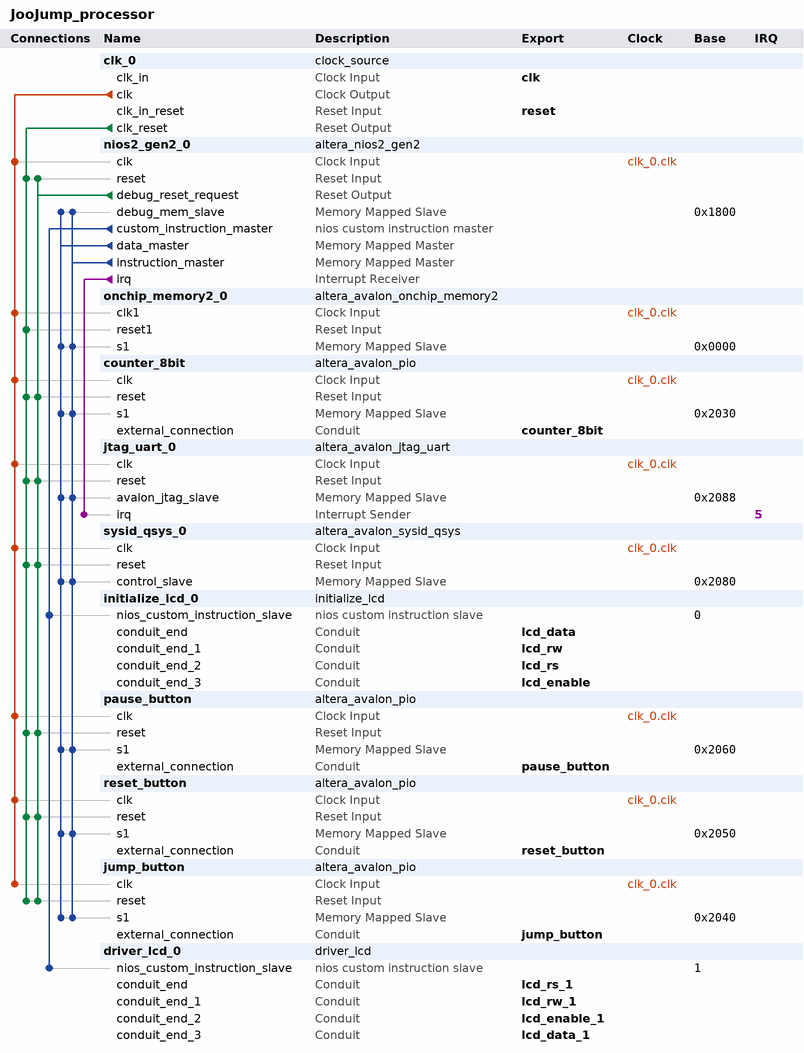
[diagram p0: system contents]
# Platform Designer (Qsys) system JooJump_processor, Cyclone IV E EP4CE6E22C8
# Parameters at their usual value, and those the tool derives, are not listed.
package require -exact qsys 18.0
create_system JooJump_processor
set_project_property DEVICE_FAMILY {Cyclone IV E}
set_project_property DEVICE EP4CE6E22C8

add_instance clk_0 clock_source 18.0
set_instance_parameter_value clk_0 clockFrequency 50000000

add_instance nios2_gen2_0 altera_nios2_gen2 18.0
set_instance_parameter_value nios2_gen2_0 dcache_size 2048
set_instance_parameter_value nios2_gen2_0 exceptionSlave onchip_memory2_0.s1
set_instance_parameter_value nios2_gen2_0 icache_size 4096
set_instance_parameter_value nios2_gen2_0 impl Tiny
set_instance_parameter_value nios2_gen2_0 resetSlave onchip_memory2_0.s1

add_instance onchip_memory2_0 altera_avalon_onchip_memory2 18.0
set_instance_parameter_value onchip_memory2_0 dataWidth 32
set_instance_parameter_value onchip_memory2_0 dualPort false
set_instance_parameter_value onchip_memory2_0 initMemContent true
set_instance_parameter_value onchip_memory2_0 initializationFileName onchip_mem.hex
set_instance_parameter_value onchip_memory2_0 memorySize 4096
set_instance_parameter_value onchip_memory2_0 useNonDefaultInitFile true

add_instance counter_8bit altera_avalon_pio 18.0
set_instance_parameter_value counter_8bit direction Input
set_instance_parameter_value counter_8bit width 8

add_instance jtag_uart_0 altera_avalon_jtag_uart 18.0
set_instance_parameter_value jtag_uart_0 simInteractiveOptions NO_INTERACTIVE_WINDOWS

add_instance sysid_qsys_0 altera_avalon_sysid_qsys 18.0
set_instance_parameter_value sysid_qsys_0 id 0

add_instance initialize_lcd_0 initialize_lcd 1.0

add_instance pause_button altera_avalon_pio 18.0
set_instance_parameter_value pause_button direction Input
set_instance_parameter_value pause_button width 1

add_instance reset_button altera_avalon_pio 18.0
set_instance_parameter_value reset_button direction Input
set_instance_parameter_value reset_button width 1

add_instance jump_button altera_avalon_pio 18.0
set_instance_parameter_value jump_button direction Input
set_instance_parameter_value jump_button width 1

add_instance driver_lcd_0 driver_lcd 1.0

# connections
add_connection clk_0.clk counter_8bit.clk clock
add_connection clk_0.clk jtag_uart_0.clk clock
add_connection clk_0.clk jump_button.clk clock
add_connection clk_0.clk nios2_gen2_0.clk clock
add_connection clk_0.clk onchip_memory2_0.clk1 clock
add_connection clk_0.clk pause_button.clk clock
add_connection clk_0.clk reset_button.clk clock
add_connection clk_0.clk sysid_qsys_0.clk clock
add_connection clk_0.clk_reset counter_8bit.reset reset
add_connection clk_0.clk_reset jtag_uart_0.reset reset
add_connection clk_0.clk_reset jump_button.reset reset
add_connection clk_0.clk_reset nios2_gen2_0.reset reset
add_connection clk_0.clk_reset onchip_memory2_0.reset1 reset
add_connection clk_0.clk_reset pause_button.reset reset
add_connection clk_0.clk_reset reset_button.reset reset
add_connection clk_0.clk_reset sysid_qsys_0.reset reset
add_connection nios2_gen2_0.debug_reset_request counter_8bit.reset reset
add_connection nios2_gen2_0.debug_reset_request jtag_uart_0.reset reset
add_connection nios2_gen2_0.debug_reset_request jump_button.reset reset
add_connection nios2_gen2_0.debug_reset_request nios2_gen2_0.reset reset
add_connection nios2_gen2_0.debug_reset_request pause_button.reset reset
add_connection nios2_gen2_0.debug_reset_request reset_button.reset reset
add_connection nios2_gen2_0.debug_reset_request sysid_qsys_0.reset reset
add_connection nios2_gen2_0.data_master counter_8bit.s1 avalon
set_connection_parameter_value nios2_gen2_0.data_master/counter_8bit.s1 baseAddress 0x2030
add_connection nios2_gen2_0.data_master jtag_uart_0.avalon_jtag_slave avalon
set_connection_parameter_value nios2_gen2_0.data_master/jtag_uart_0.avalon_jtag_slave baseAddress 0x2088
add_connection nios2_gen2_0.data_master jump_button.s1 avalon
set_connection_parameter_value nios2_gen2_0.data_master/jump_button.s1 baseAddress 0x2040
add_connection nios2_gen2_0.data_master nios2_gen2_0.debug_mem_slave avalon
set_connection_parameter_value nios2_gen2_0.data_master/nios2_gen2_0.debug_mem_slave baseAddress 0x1800
add_connection nios2_gen2_0.data_master onchip_memory2_0.s1 avalon
set_connection_parameter_value nios2_gen2_0.data_master/onchip_memory2_0.s1 baseAddress 0x0000
add_connection nios2_gen2_0.data_master pause_button.s1 avalon
set_connection_parameter_value nios2_gen2_0.data_master/pause_button.s1 baseAddress 0x2060
add_connection nios2_gen2_0.data_master reset_button.s1 avalon
set_connection_parameter_value nios2_gen2_0.data_master/reset_button.s1 baseAddress 0x2050
add_connection nios2_gen2_0.data_master sysid_qsys_0.control_slave avalon
set_connection_parameter_value nios2_gen2_0.data_master/sysid_qsys_0.control_slave baseAddress 0x2080
add_connection nios2_gen2_0.instruction_master counter_8bit.s1 avalon
set_connection_parameter_value nios2_gen2_0.instruction_master/counter_8bit.s1 baseAddress 0x2030
add_connection nios2_gen2_0.instruction_master jtag_uart_0.avalon_jtag_slave avalon
set_connection_parameter_value nios2_gen2_0.instruction_master/jtag_uart_0.avalon_jtag_slave baseAddress 0x2088
add_connection nios2_gen2_0.instruction_master jump_button.s1 avalon
set_connection_parameter_value nios2_gen2_0.instruction_master/jump_button.s1 baseAddress 0x2040
add_connection nios2_gen2_0.instruction_master nios2_gen2_0.debug_mem_slave avalon
set_connection_parameter_value nios2_gen2_0.instruction_master/nios2_gen2_0.debug_mem_slave baseAddress 0x1800
add_connection nios2_gen2_0.instruction_master onchip_memory2_0.s1 avalon
set_connection_parameter_value nios2_gen2_0.instruction_master/onchip_memory2_0.s1 baseAddress 0x0000
add_connection nios2_gen2_0.instruction_master pause_button.s1 avalon
set_connection_parameter_value nios2_gen2_0.instruction_master/pause_button.s1 baseAddress 0x2060
add_connection nios2_gen2_0.instruction_master reset_button.s1 avalon
set_connection_parameter_value nios2_gen2_0.instruction_master/reset_button.s1 baseAddress 0x2050
add_connection nios2_gen2_0.instruction_master sysid_qsys_0.control_slave avalon
set_connection_parameter_value nios2_gen2_0.instruction_master/sysid_qsys_0.control_slave baseAddress 0x2080
add_connection nios2_gen2_0.irq jtag_uart_0.irq interrupt
set_connection_parameter_value nios2_gen2_0.irq/jtag_uart_0.irq irqNumber 5
add_connection nios2_gen2_0.custom_instruction_master driver_lcd_0.nios_custom_instruction_slave nios_custom_instruction
set_connection_parameter_value nios2_gen2_0.custom_instruction_master/driver_lcd_0.nios_custom_instruction_slave CIName driver_lcd_0
set_connection_parameter_value nios2_gen2_0.custom_instruction_master/driver_lcd_0.nios_custom_instruction_slave baseAddress 1
add_connection nios2_gen2_0.custom_instruction_master initialize_lcd_0.nios_custom_instruction_slave nios_custom_instruction
set_connection_parameter_value nios2_gen2_0.custom_instruction_master/initialize_lcd_0.nios_custom_instruction_slave CIName initialize_lcd_0
set_connection_parameter_value nios2_gen2_0.custom_instruction_master/initialize_lcd_0.nios_custom_instruction_slave baseAddress 0

# exported interfaces
add_interface clk clock sink
set_interface_property clk EXPORT_OF clk_0.clk_in
add_interface counter_8bit conduit end
set_interface_property counter_8bit EXPORT_OF counter_8bit.external_connection
add_interface jump_button conduit end
set_interface_property jump_button EXPORT_OF jump_button.external_connection
add_interface lcd_data conduit end
set_interface_property lcd_data EXPORT_OF initialize_lcd_0.conduit_end
add_interface lcd_data_1 conduit end
set_interface_property lcd_data_1 EXPORT_OF driver_lcd_0.conduit_end_3
add_interface lcd_enable conduit end
set_interface_property lcd_enable EXPORT_OF initialize_lcd_0.conduit_end_3
add_interface lcd_enable_1 conduit end
set_interface_property lcd_enable_1 EXPORT_OF driver_lcd_0.conduit_end_2
add_interface lcd_rs conduit end
set_interface_property lcd_rs EXPORT_OF initialize_lcd_0.conduit_end_2
add_interface lcd_rs_1 conduit end
set_interface_property lcd_rs_1 EXPORT_OF driver_lcd_0.conduit_end
add_interface lcd_rw conduit end
set_interface_property lcd_rw EXPORT_OF initialize_lcd_0.conduit_end_1
add_interface lcd_rw_1 conduit end
set_interface_property lcd_rw_1 EXPORT_OF driver_lcd_0.conduit_end_1
add_interface pause_button conduit end
set_interface_property pause_button EXPORT_OF pause_button.external_connection
add_interface reset reset sink
set_interface_property reset EXPORT_OF clk_0.clk_in_reset
add_interface reset_button conduit end
set_interface_property reset_button EXPORT_OF reset_button.external_connection

set_interconnect_requirement {$system} qsys_mm.clockCrossingAdapter HANDSHAKE
set_interconnect_requirement {$system} qsys_mm.enableEccProtection FALSE
set_interconnect_requirement {$system} qsys_mm.insertDefaultSlave FALSE
set_interconnect_requirement {$system} qsys_mm.maxAdditionalLatency 1

save_system JooJump_processor.qsys
